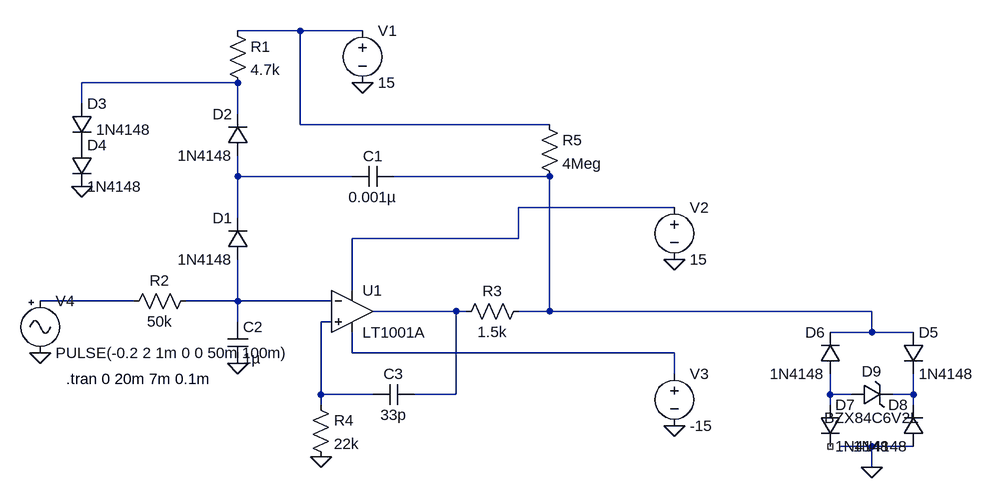
[diagram p0: schematic V-F converter.asc]
V-F converter.asc, the LTspice schematic file:
Version 4
SHEET 1 1280 836
WIRE 240 -224 144 -224
WIRE 336 -224 240 -224
WIRE 144 -144 -96 -144
WIRE -96 -112 -96 -144
WIRE 144 -96 144 -144
WIRE 240 -80 240 -224
WIRE 624 -80 240 -80
WIRE 144 0 144 -32
WIRE 320 0 144 0
WIRE 624 0 384 0
WIRE 816 48 576 48
WIRE 144 64 144 0
WIRE 576 96 576 48
WIRE 576 96 320 96
WIRE 320 176 320 96
WIRE -16 192 -160 192
WIRE 144 192 144 128
WIRE 144 192 64 192
WIRE 288 192 144 192
WIRE 480 208 352 208
WIRE 496 208 480 208
WIRE 624 208 624 0
WIRE 624 208 576 208
WIRE 1120 208 624 208
WIRE 144 224 144 192
WIRE 288 224 272 224
WIRE 1120 240 1120 208
WIRE 1120 240 1056 240
WIRE 1184 240 1120 240
WIRE 320 272 320 240
WIRE 816 272 320 272
WIRE 816 304 816 272
WIRE 272 336 272 224
WIRE 352 336 272 336
WIRE 480 336 480 208
WIRE 480 336 416 336
WIRE 1056 336 1056 304
WIRE 1088 336 1056 336
WIRE 1184 336 1184 304
WIRE 1184 336 1152 336
WIRE 272 352 272 336
WIRE 1056 352 1056 336
WIRE 1184 352 1184 336
WIRE 1120 416 1072 416
WIRE 1184 416 1120 416
WIRE 1120 448 1120 416
FLAG -96 16 0
FLAG 336 -144 0
FLAG 144 288 0
FLAG 816 384 0
FLAG 816 128 0
FLAG 272 432 0
FLAG 1120 448 0
FLAG -160 272 0
SYMBOL cap 384 -16 R90
WINDOW 0 0 32 VBottom 2
WINDOW 3 32 32 VTop 2
SYMATTR InstName C1
SYMATTR Value 0.001µ
SYMBOL diode 160 128 R180
WINDOW 0 24 64 Left 2
WINDOW 3 24 0 Left 2
SYMATTR InstName D1
SYMATTR Value 1N4148
SYMBOL diode 160 -32 R180
WINDOW 0 24 64 Left 2
WINDOW 3 24 0 Left 2
SYMATTR InstName D2
SYMATTR Value 1N4148
SYMBOL diode -112 -112 R0
WINDOW 3 38 40 Left 2
SYMATTR Value 1N4148
SYMATTR InstName D3
SYMBOL diode -112 -48 R0
SYMATTR InstName D4
SYMATTR Value 1N4148
SYMBOL res 128 -240 R0
SYMATTR InstName R1
SYMATTR Value 4.7k
SYMBOL voltage 336 -240 R0
SYMATTR InstName V1
SYMATTR Value 15
SYMBOL res 80 176 R90
WINDOW 0 0 56 VBottom 2
WINDOW 3 32 56 VTop 2
SYMATTR InstName R2
SYMATTR Value 50k
SYMBOL cap 128 224 R0
SYMATTR InstName C2
SYMATTR Value 1µ
SYMBOL Opamps\\LT1001A 320 144 R0
SYMATTR InstName U1
SYMBOL voltage 816 32 R0
WINDOW 123 0 0 Left 0
WINDOW 39 0 0 Left 0
SYMATTR InstName V2
SYMATTR Value 15
SYMBOL voltage 816 288 R0
WINDOW 123 0 0 Left 0
WINDOW 39 0 0 Left 0
SYMATTR InstName V3
SYMATTR Value -15
SYMBOL res 592 192 R90
WINDOW 0 0 56 VBottom 2
WINDOW 3 32 56 VTop 2
SYMATTR InstName R3
SYMATTR Value 1.5k
SYMBOL cap 416 320 R90
WINDOW 0 0 32 VBottom 2
WINDOW 3 32 32 VTop 2
SYMATTR InstName C3
SYMATTR Value 33p
SYMBOL res 256 336 R0
SYMATTR InstName R4
SYMATTR Value 22k
SYMBOL diode 1168 240 R0
SYMATTR InstName D5
SYMATTR Value 1N4148
SYMBOL diode 1072 304 R180
WINDOW 0 24 64 Left 2
WINDOW 3 24 0 Left 2
SYMATTR InstName D6
SYMATTR Value 1N4148
SYMBOL diode 1040 352 R0
SYMATTR InstName D7
SYMATTR Value 1N4148
SYMBOL diode 1200 416 R180
WINDOW 0 24 64 Left 2
WINDOW 3 24 0 Left 2
SYMATTR InstName D8
SYMATTR Value 1N4148
SYMBOL zener 1088 352 R270
WINDOW 0 36 32 VTop 2
WINDOW 3 -4 32 VBottom 2
SYMATTR InstName D9
SYMATTR Value BZX84C6V2L
SYMBOL Misc\\signal -160 176 R0
WINDOW 123 0 0 Left 0
WINDOW 39 0 0 Left 0
SYMATTR InstName V4
SYMATTR Value PULSE(-0.2 2 1m 0 0 50m 100m)
SYMBOL res 608 -96 R0
SYMATTR InstName R5
SYMATTR Value 4Meg
TEXT -120 312 Left 2 !.tran 0 20m 7m 0.1m

The netlist it stands for:
* V-F converter.asc
C1 N004 N003 0.001µ
D1 N007 N003 1N4148
D2 N003 N002 1N4148
D3 N002 P001 1N4148
D4 P001 0 1N4148
R1 N001 N002 4.7k
V1 N001 0 15
R2 N007 N006 50k
C2 N007 0 1µ
XU1 N009 N007 N005 N010 N008 LT1001  ; LT1001A, pins In+ In- V+ V- OUT
V2 N005 0 15
V3 N010 0 -15
R3 N004 N008 1.5k
C3 N008 N009 33p
R4 N009 0 22k
D5 N004 N012 1N4148
D6 N011 N004 1N4148
D7 N011 NC_01 1N4148
D8 0 N012 1N4148
D9 N011 N012 BZX84C6V2L
V4 N006 0 PULSE(-0.2 2 1m 0 0 50m 100m)
R5 N001 N004 4Meg
.model D D
.lib standard.dio
.tran 0 20m 7m 0.1m
.lib LTC.lib
.backanno
.end